# EAGLE design GPS_dev_board (EAGLE 6.3)
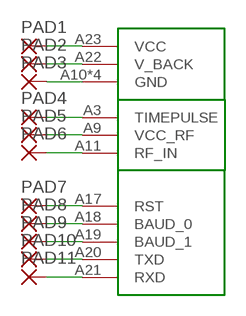
[diagram p0: schematic, sheet 1]

## Parts
PAD1  2,54/0,8  [2,54/0,8]
PAD2  2,54/0,8  [2,54/0,8]
PAD3  2,54/0,8  [2,54/0,8]
PAD4  2,54/0,8  [2,54/0,8]
PAD5  2,54/0,8  [2,54/0,8]
PAD6  2,54/0,8  [2,54/0,8]
PAD7  2,54/0,8  [2,54/0,8]
PAD8  2,54/0,8  [2,54/0,8]
PAD9  2,54/0,8  [2,54/0,8]
PAD10  2,54/0,8  [2,54/0,8]
PAD11  2,54/0,8  [2,54/0,8]
U$1  GTS-4E-60  [GTS-4E-60]

## Nets
N$1: PAD1.1(P) U$1.A23(VCC)
N$2: PAD2.1(P) U$1.A22(V_BACK)
N$3: PAD3.1(P) U$1.A10(GND) U$1.A12(GND) U$1.A13(GND) U$1.A24(GND)
N$4: PAD4.1(P) U$1.A3(TIMEPULSE)
N$5: PAD5.1(P) U$1.A9(VCC_RF)
N$6: PAD6.1(P) U$1.A11(RF_IN)
N$7: PAD7.1(P) U$1.A17(RST)
N$8: PAD8.1(P) U$1.A18(BAUD_0)
N$9: PAD9.1(P) U$1.A19(BAUD_1)
N$10: PAD10.1(P) U$1.A20(TXD)
N$11: PAD11.1(P) U$1.A21(RXD)

## Library data of the parts
PAD1-PAD11 = wirepad:2,54/0,8: THROUGH-HOLE PAD
U$1 = ref-packages:GTS-4E-60

## Net classes
0 default: clearance 0.5 mm

## Board
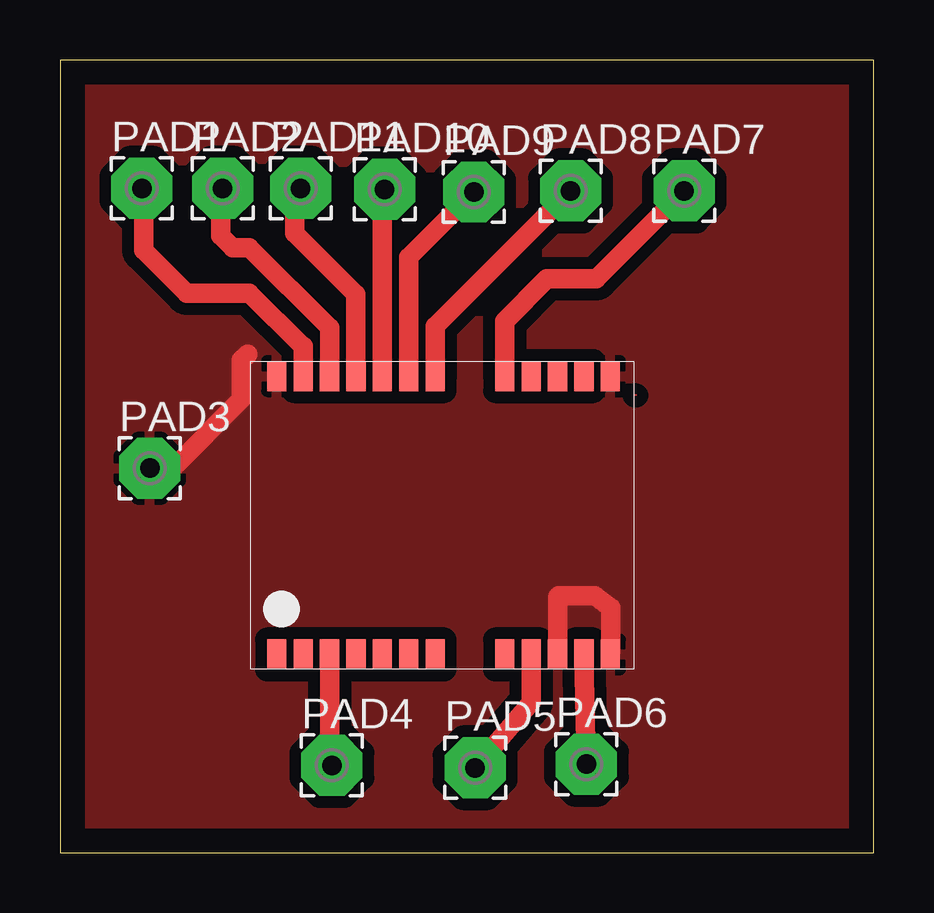
[diagram p1: board, top side]

Size 33.91 x 33.04 mm. Coordinates in mm from the lower left corner, seen from the top.
Outline: 0,0 33.91,0 33.91,33.04 0,33.04 0,0
Copper layers (1*16): Top 0.035mm / dielectric 1.5mm / Bottom 0.035mm
Design rules "default": minimum track width 10mil, minimum drill 24mil, track to track 8mil, track to pad 8mil, pad to pad 8mil, via to via 8mil, smd to smd 8mil, copper to edge 40mil, drill to drill 8mil, minimum pad ring 10mil, minimum via ring 8mil, stop-mask expansion 4mil, vias tented up to drill 0mil, thermal gap 10mil

### Footprints (pad centres in the part's own frame; a part is rotated, then mirrored left to right if it is on the bottom)
2,54/0,8 = drill 0.813 pad 2.54 octagon: 1 0,0
GTS-4E-60 = smd 1.25 x 0.8: A1 5.5,-6.9; A2 5.5,-5.8; A3 5.5,-4.7; A4 5.5,-3.6; A5 5.5,-2.5; A6 5.5,-1.4; A7 5.5,-0.3; A8 5.5,2.6; A9 5.5,3.7; A10 5.5,4.8; A11 5.5,5.9; A12 5.5,7; A13 -6.1,7; A14 -6.1,5.9; A15 -6.1,4.8; A16 -6.1,3.7; A17 -6.1,2.6; A18 -6.1,-0.3; A19 -6.1,-1.4; A20 -6.1,-2.5; A21 -6.1,-3.6; A22 -6.1,-4.7; A23 -6.1,-5.8; A24 -6.1,-6.9

### Placement (x,y rotation side)
PAD1  3.41,27.69 0 top
PAD2  6.78,27.69 0 top
PAD3  3.74,16.03 0 top
PAD4  11.33,3.65 0 top
PAD5  17.3,3.55 0 top
PAD6  21.93,3.7 0 top
PAD7  26.01,27.59 0 top
PAD8  21.28,27.59 0 top
PAD9  17.24,27.54 0 top
PAD10  13.53,27.65 0 top
PAD11  10.03,27.69 0 top
U$1  15.93,13.77 270 top

### Tracks (layer width: path | path; a pad name or v marks a point on that pad's centre or on a via)
N$1
  Top 0.813: U$1.A23 10.13,21.1 10.11,21.1 7.89,23.32 5.29,23.32 3.49,25.12 3.49,27.61 PAD1.1
N$2
  Top 0.813: U$1.A22 11.23,21.88 7.89,25.22 7.19,25.22 6.69,25.72 6.69,27.6 PAD2.1
N$3
  Top 0.813: PAD3.1 4.69,16.03 7.56,18.9 7.56,20.52 7.83,20.79 | U$1.A10 20.73,10.66 20.79,10.72 22.29,10.72 22.95,10.23 22.95,8.42 U$1.A12
  pour Top: -0.81,-4.59 35.37,-5.13 35.37,40.23 -4.05,40.77 -4.05,-4.59
N$4
  Top 0.813: U$1.A3 11.23,4.35 PAD4.1
N$5
  Top 0.813: U$1.A9 19.63,6.28 PAD5.1
N$6
  Top 0.813: U$1.A11 PAD6.1
N$7
  Top 0.813: U$1.A17 18.53,22.16 20.29,23.92 22.34,23.92 PAD7.1
N$8
  Top 0.813: U$1.A18 15.63,21.94 PAD8.1
N$9
  Top 0.813: U$1.A19 14.53,24.83 PAD9.1
N$10
  Top 0.813: U$1.A20 13.43,27.55 PAD10.1
N$11
  Top 0.813: U$1.A21 12.33,23.28 9.79,25.82 9.79,27.45 PAD11.1